# EAGLE schematic PE10 (EAGLE 9.6.2)
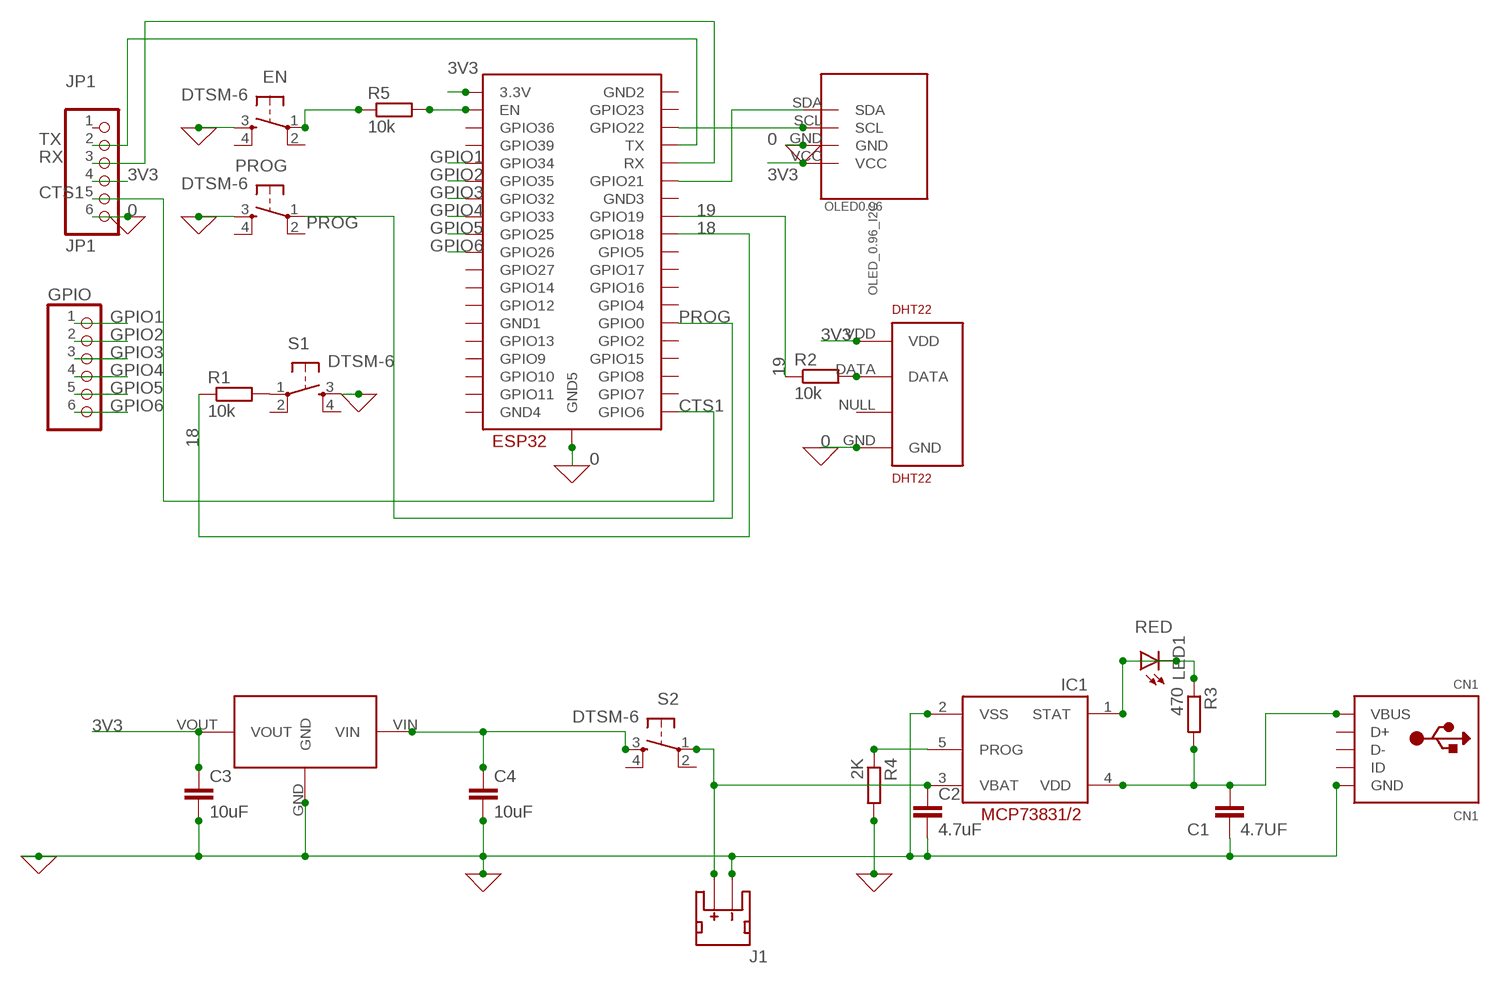
[diagram p0: schematic, sheet 1]

## Parts
C1  4.7UF  C-EUC1812K  [C1812K]
C2  4.7uF  C-EUC1812K  [C1812K]
C3  10uF  C-EUC1812K  [C1812K]
C4  10uF  C-EUC1812K  [C1812K]
CN1  CN1  USBMINIB  [USB-MINIB]
DHT22  DHT22  RHT03_DHT-22_AM2302  [RHT03_DHT-22]
EN  DTSM-6  [DTSM-6]
GPIO  PINHD-1X6  [1X06]
HT7333-7  HT7333  [SOT89]
IC1  MCP73831/OT  [SOT23-5L]
J1  5V  JST_2MM_MALE  [JST-2-SMD]
JP1  JP1  PINHD-1X6  [1X06]
LED1  RED  LEDSMART-LED  [SMART-LED]
OLED0.96  OLED_0.96_I2C  [OLED_0.96_I2C]
PROG  DTSM-6  [DTSM-6]
R1  10k  R-EU_R1206W  [R1206W]
R2  10k  R-EU_R1206W  [R1206W]
R3  470  R-EU_R1206W  [R1206W]
R4  2K  R-EU_R1206W  [R1206W]
R5  10k  R-EU_R1206W  [R1206W]
S1  DTSM-6  [DTSM-6]
S2  DTSM-6  [DTSM-6]
U$1  ESP32-WROOM  [ESP32-WROOM]

## Nets
0: C1.2 C2.2 C3.2 C4.2 CN1.GND DHT22.GND EN.3 HT7333-7.GND IC1.2(VSS) J1.1(-) JP1.6 OLED0.96.GND PROG.3 R4.2 S1.3 U$1.GND5 ; supply symbol labelled GND
3V3: C3.1 DHT22.VDD HT7333-7.VOUT JP1.4 OLED0.96.VCC U$1.3V3(3.3V)
18: R1.1 U$1.IO18(GPIO18)
19: R2.1 U$1.IO19(GPIO19)
CTS1: JP1.5 U$1.CLK(GPIO6)
GPIO1: GPIO.1 U$1.IO34(GPIO34)
GPIO2: GPIO.2 U$1.IO35(GPIO35)
GPIO3: GPIO.3 U$1.IO32(GPIO32)
GPIO4: GPIO.4 U$1.IO33(GPIO33)
GPIO5: GPIO.5 U$1.IO25(GPIO25)
GPIO6: GPIO.6 U$1.IO26(GPIO26)
N$1: OLED0.96.SCL U$1.IO22(GPIO22)
N$2: OLED0.96.SDA U$1.IO21(GPIO21)
N$3: DHT22.DATA R2.2
N$4: R1.2 S1.1
N$5: C1.1 CN1.VBUS IC1.4(VDD) R3.2
N$6: C4.1 HT7333-7.VIN S2.3
N$7: IC1.1(STAT) LED1.A LED1.B(C) R3.1
N$8: C2.1 IC1.3(VBAT) J1.2(+) S2.1
N$10: EN.1 R5.1
N$12: IC1.5(PROG) R4.1
N$13: R5.2 U$1.EN
PROG: PROG.1 U$1.IO0(GPIO0)
RX: JP1.3 U$1.RX
TX: JP1.2 U$1.TX
Unconnected: CN1.D+ CN1.D- CN1.ID DHT22.NULL EN.2 EN.4 J1.NC1(PAD1) J1.NC2(PAD2) JP1.1 PROG.2 PROG.4 S1.2 S1.4 S2.2 S2.4 U$1.CMD(GPIO11) U$1.GND1 U$1.GND2 U$1.GND3 U$1.GND4 U$1.IO2(GPIO2) U$1.IO4(GPIO4) U$1.IO5(GPIO5) U$1.IO12(GPIO12) U$1.IO13(GPIO13) U$1.IO14(GPIO14) U$1.IO15(GPIO15) U$1.IO16(GPIO16) U$1.IO17(GPIO17) U$1.IO23(GPIO23) U$1.IO27(GPIO27) U$1.SD0(GPIO7) U$1.SD1(GPIO8) U$1.SD2(GPIO9) U$1.SD3(GPIO10) U$1.SENSOR_VN(GPIO39) U$1.SENSOR_VP(GPIO36)

## Library data of the parts
C1-C4 = rcl:C-EU: CAPACITOR, European symbol; SPICEPREFIX: C
CN1 = adafruit:USB: USB Connectors USBMINIB - Surface Mount Female Mini-B USB Connector 4UConnector: 06564 By microbuilder.eu Thru-hole RA Female Mini-B USB Connector 4UConnector: 18732 By ladyada.net
DHT22 = RHT03_DHT-22_AM2302:RHT03_DHT-22_AM2302: RHT03 / DHT-22 / AM2302 Packages and symbol for the RHT03 / DHT-22 relative humidity and temperature sensor. Note: The AM2302 is a wired version of the DHT-22 which typically requires less clearance and is thus provided as a separate package.; PROD_ID: SEN-10167
EN PROG S1 S2 = switch-tact:DTSM-6
GPIO JP1 = adafruit:PINHD-1X6: PIN HEADER
HT7333-7 = HT7333_SOT89:HT7333
IC1 = adafruit:MCP73831: MCP73831/2 Miniature Single-Cell, Fully Integrated Li-Ion, Li-Polymer Charge Management Controllers. Nice and small simple lipoly charge controller, with adjustable current and status output (LED) http://www.ladyada.net/library/pcb/eaglelibrary.html
J1 = SparkFun-Connectors:JST_2MM_MALE: JST 2MM MALE RA CONNECTOR Two pin, compact surface mount connector. Commonly used as a battery input connection point. We really like the solid locking feeling and high current rating on these small connectors. We use these all the time as battery connectors. Mates to single-cell LiPo batteries. Here is the connector we sell at SparkFun: JST Right Angle Connector - White <https://www.sparkfun.com/products/8612> (PRT-08612) Datasheet <http://www.sparkfun.com/datasheets/Prototyping/Connectors/JST-Horizontal.pdf> It was used on these SparkFun products: SparkFun MOSFET Power Controller <https://www.sparkfun.com/products/11214> (PRT-11214) SparkFun Battery Babysitter - LiPo Battery Manager <https://www.sparkfun.com/products/13777> (PRT-13777) And many, many others that required a lipo battery connection.; PROD_ID: CONN-11443; SF_ID: PRT-08612
LED1 = adafruit:LED: LED OSRAM: - CHIPLED LG R971, LG N971, LY N971, LG Q971, LY Q971, LO R971, LY R971 LH N974, LH R974 LS Q976, LO Q976, LY Q976 LO Q996 - Hyper CHIPLED LW Q18S LB Q993, LB Q99A, LB R99A - SideLED LS A670, LO A670, LY A670, LG A670, LP A670 LB A673, LV A673, LT A673, LW A673 LH A674 LY A675 LS A676, LA A676, LO A676, LY A676, LW A676 LS A679, LY A679, LG A679 - Hyper Micro SIDELED® LS Y876, LA Y876, LO Y876, LY Y876 LT Y87S - SmartLED LW L88C, LW L88S LB L89C, LB L89S, LG L890 LS L89K, LO L89K, LY L89K LS L896, LA L896, LO L896, LY L896 - TOPLED LS T670, LO T670, LY T670, LG T670, LP T670 LSG T670, LSP T670, LSY T670, LOP T670, LYG T670 LG T671, LOG T671, LSG T671 LB T673, LV T673, LT T673, LW T673 LH T674 LS T676, LA T676, LO T676, LY T676, LB T676, LH T676, LSB T676, LW T676 LB T67C, LV T67C, LT T67C, LS T67K, LO T67K, LY T67K, LW E67C LS E67B, LA E67B, LO E67B, LY E67B, LB E67C, LV E67C, LT E67C LW T67C LS T679, LY T679, LG T679 LS T770, LO T770, LY T770, LG T770, LP T770 LB T773, LV T773, LT T773, LW T773 LH T774 LS E675, LA E675, LY E675, LS T675 LS T776, LA T776, LO T776, LY T776, LB T776 LHGB T686 LT T68C, LB T68C - Hyper Mini TOPLED® LB M676 - Mini TOPLED Santana® LG M470 LS M47K, LO M47K, LY M47K Source: http://www.osram.convergy.de/
OLED0.96 = tft_1_8_1_44_oled_0_96:OLED_0.96_I2C
R1-R5 = rcl:R-EU_: RESISTOR, European symbol; SPICEPREFIX: R
U$1 = ESP32:ESP32-WROOM